# EAGLE board SchematicControlPlotter (EAGLE 9.1.2), part 1 of 2
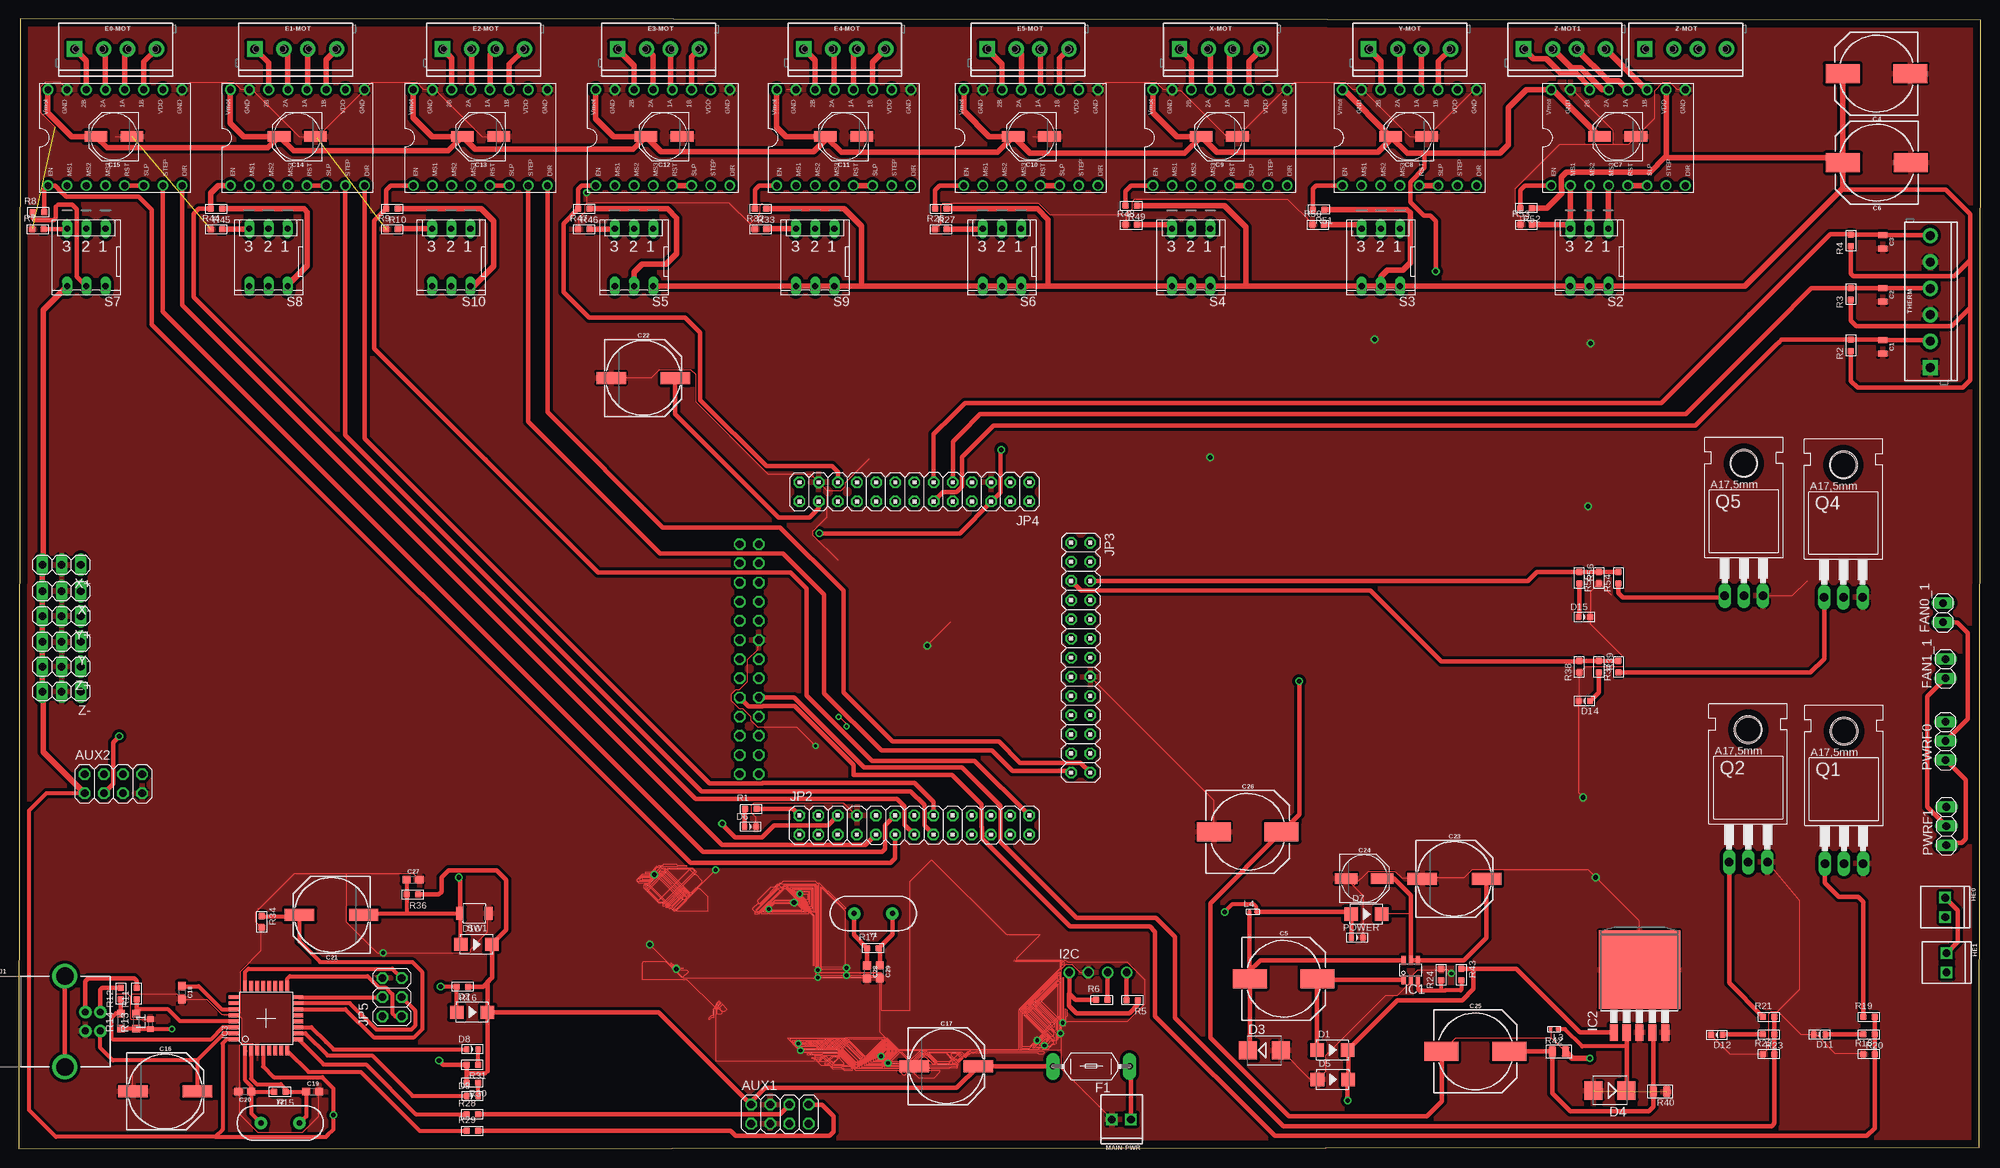
[diagram p5: board, top side]
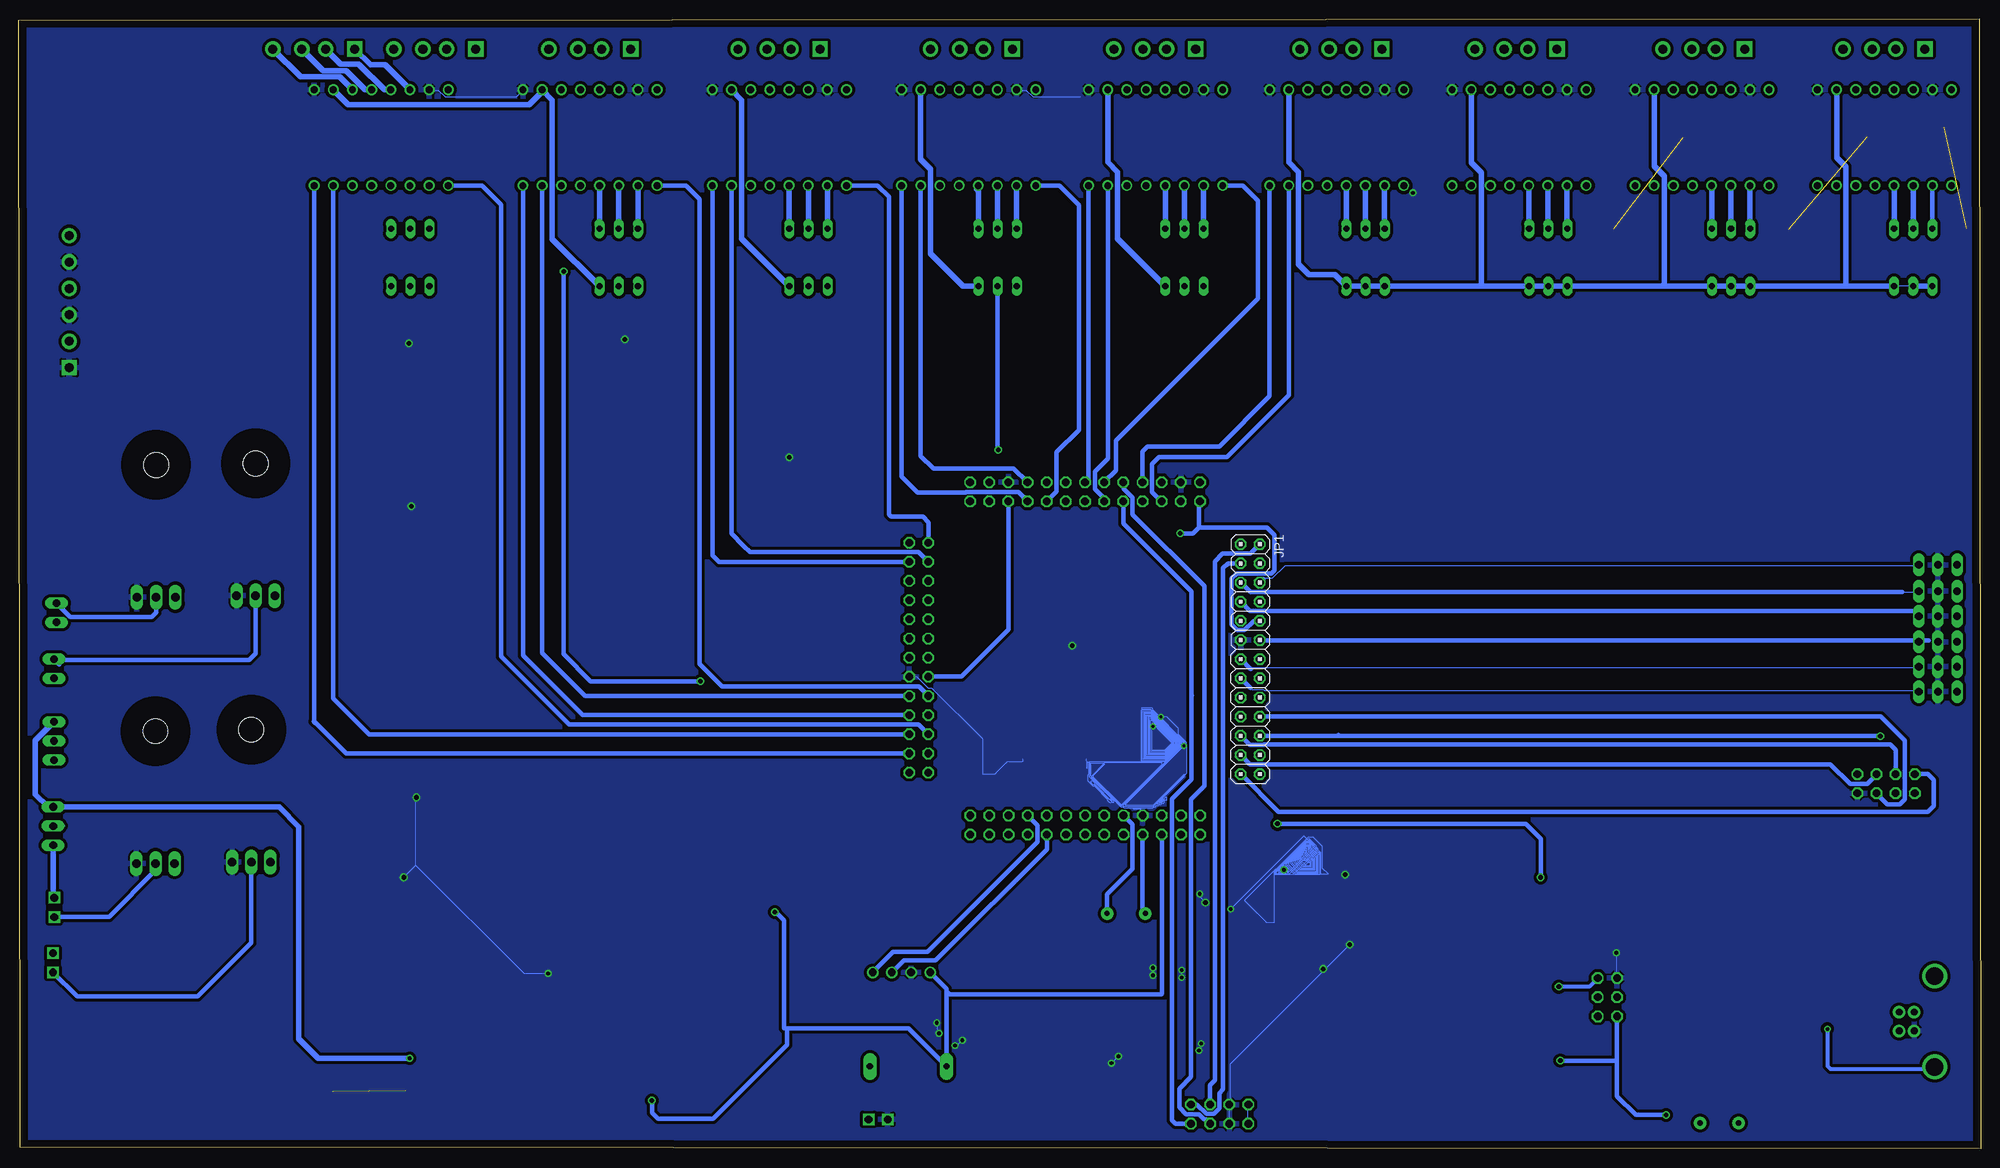
[diagram p6: board, bottom side, seen from below]

Size 260 x 149.8 mm. Coordinates in mm from the lower left corner, seen from the top.
Outline: 0,0 259.8,0.2 260,149.6 0.2,149.8 0,0
Copper layers (1*16): Top 0.035mm / dielectric 1.5mm / Bottom 0.035mm
Design rules "default": minimum track width 6mil, minimum drill 0.35mm, track to track 6mil, track to pad 6mil, pad to pad 6mil, via to via 6mil, smd to smd 6mil, copper to edge 40mil, drill to drill 6mil, minimum pad ring 10mil, minimum via ring 8mil, stop-mask expansion 4mil, vias tented up to drill 0mil, thermal gap 10mil

## Footprints (pad centres in the part's own frame; a part is rotated, then mirrored left to right if it is on the bottom)
2X04 = drill 1.016 octagon: 1 -3.81,-1.27; 2 -3.81,1.27; 3 -1.27,-1.27; 4 -1.27,1.27; 5 1.27,-1.27; 6 1.27,1.27; 7 3.81,-1.27; 8 3.81,1.27
0805 = smd 0.8 x 1.2: 1 -0.9,0; 2 0.9,0
NIC_10X10.5_CAP = smd 4.5 x 2.5: + 4.5,0; - -4.5,0
PANASONIC_D = smd 3 x 1.4: + 2.4,0; - -2.4,0
PANASONIC_G = smd 3.9 x 1.6: + 4.25,0; - -4.25,0
0603 = smd 1.1 x 1: 1 -0.85,0; 2 0.85,0
DO-214AC = smd 1.8 x 1.77: 1 -2.042,0; 2 2.042,0
SMB = smd 2.4 x 2.4: A 2.2,0; C -2.2,0
LED-0603 = smd 0.762 x 0.889: + -0.762,0; - 0.762,0
SCREWTERMINAL-3.5MM-4_LOCK = drill 1.2 pad 2.032 square: 1 -0.178,0 | drill 1.2 pad 2.032: 2 3.678,0; 3 6.822,0; 4 10.678,0
LITTLEFUSE = drill 0.813 pad 1.778 long: 1 -5.08,0; 2 5.08,0
1X02 = drill 1.016 long: 1 -1.27,0; 2 1.27,0
1X02_2.54_SCREWTERM = drill 1.016 square: P1 2.54,0; P2 0,0
1X04 = drill 1.016: 1 -2.54,0; 2 0,0; 3 2.54,0; 4 5.08,0
SOT23-6 = smd 0.55 x 1.2: 1 -0.95,-1.3; 2 0,-1.3; 3 0.95,-1.3; 4 0.95,1.3; 5 0,1.3; 6 -0.95,1.3
TO263-5 = smd 1.067 x 2.159: 1 -3.404,-5.791; 2 -1.702,-5.791; 3 0,-5.791; 4 1.702,-5.791; 5 3.404,-5.791 | smd 10.8 x 10.41: 6 0,2.54
TQFP32-08 = smd 1.27 x 0.508: 1 -4.293,2.8; 2 -4.293,2; 3 -4.293,1.2; 4 -4.293,0.4; 5 -4.293,-0.4; 6 -4.293,-1.2; 7 -4.293,-2; 8 -4.293,-2.8; 17 4.293,-2.8; 18 4.293,-2; 19 4.293,-1.2; 20 4.293,-0.4; 21 4.293,0.4; 22 4.293,1.2; 23 4.293,2; 24 4.293,2.8 | smd 0.508 x 1.27: 9 -2.8,-4.293; 10 -2,-4.293; 11 -1.2,-4.293; 12 -0.4,-4.293; 13 0.4,-4.293; 14 1.2,-4.293; 15 2,-4.293; 16 2.8,-4.293; 25 2.8,4.293; 26 2,4.293; 27 1.2,4.293; 28 0.4,4.293; 29 -0.4,4.293; 30 -1.2,4.293; 31 -2,4.293; 32 -2.8,4.293
USB-B-PTH = drill 0.914 pad 1.676: D+ 4,1.25; D- 5.981,1.25; GND 4,-1.25; VBUS 5.981,-1.25 | drill 2.286: SHLD1 1.282,-6.02; SHLD2 1.282,6.02
2X13 = drill 1.016 octagon: 1 -15.24,-1.27; 2 -15.24,1.27; 3 -12.7,-1.27; 4 -12.7,1.27; 5 -10.16,-1.27; 6 -10.16,1.27; 7 -7.62,-1.27; 8 -7.62,1.27; 9 -5.08,-1.27; 10 -5.08,1.27; 11 -2.54,-1.27; 12 -2.54,1.27; 13 0,-1.27; 14 0,1.27; 15 2.54,-1.27; 16 2.54,1.27; 17 5.08,-1.27; 18 5.08,1.27; 19 7.62,-1.27; 20 7.62,1.27; 21 10.16,-1.27; 22 10.16,1.27; 23 12.7,-1.27; 24 12.7,1.27; 25 15.24,-1.27; 26 15.24,1.27
2X03 = drill 1.016 octagon: 1 -2.54,-1.27; 2 -2.54,1.27; 3 0,-1.27; 4 0,1.27; 5 2.54,-1.27; 6 2.54,1.27
0402 = smd 0.7 x 0.9: 1 -0.65,0; 2 0.65,0
L0402 = smd 0.5 x 0.5: 1 -0.463,0; 2 0.463,0
1X03 = drill 1.016 long: 1 -2.54,0; 2 0,0; 3 2.54,0
TO220BH = drill 1.118 long: D 0,-6.35; G -2.54,-6.35; S 2.54,-6.35 | hole 3.302: 0,11.176
R0603 = smd 0.889 x 0.889: 1 0,0.762; 2 0,-0.762
CT/CN0603 = smd 1 x 1: 1 -1,0; 2 1,0
R0805 = smd 1.397 x 1.016: 1 0,0.889; 2 0,-0.889
DP-03 = drill 0.813 long: 1 -2.54,-3.81; 2 0,-3.81; 3 2.54,-3.81; 4 2.54,3.81; 5 0,3.81; 6 -2.54,3.81
SW2-2.6-3.0X2.5X1.2+0.4MM = smd 1 x 1.7: 1 -1.9,0; 2 1.9,0
SCREWTERMINAL-3.5MM-6 = drill 1.2 pad 2.032 square: 1 0,0 | drill 1.2 pad 2.032: 2 3.5,0; 3 7,0; 4 10.5,0; 5 14,0; 6 17.5,0
A4988BREAKOUT = drill 0.9: 1A 8.89,1.27; 1B 11.43,1.27; 2A 6.35,1.27; 2B 3.81,1.27; DIR 16.51,-11.43; EN -1.27,-11.43; GND 16.51,1.27; GND@0 1.27,1.27; MS1 1.27,-11.43; MS2 3.81,-11.43; MS3 6.35,-11.43; RST 8.89,-11.43; SLP 11.43,-11.43; STEP 13.97,-11.43; VDD 13.97,1.27; VMOT -1.27,1.27
HC49US = drill 0.7 pad 1.651: 1 -2.54,0; 2 2.54,0

## Placement (x,y rotation side)
AUX1  [2X04]  100.86,4.61 0 top
AUX2  [2X04]  12.53,48.41 0 top
C1  1.0uF  [0805]  247.01,106.3 270 top
C2  1.0uF  [0805]  247.01,113.21 270 top
C3  1.0uF  [0805]  247.01,120.22 270 top
C4  100uF  [NIC_10X10.5_CAP]  246.2,142.54 180 top
C5  100nF  [NIC_10X10.5_CAP]  167.63,22.56 0 top
C6  100uF  [NIC_10X10.5_CAP]  246.24,130.74 180 top
C7  100uF  [PANASONIC_D]  211.9,134.2 180 top
C8  100uF  [PANASONIC_D]  184.2,134.2 180 top
C9  100uF  [PANASONIC_D]  159.1,134.2 180 top
C10  100uF  [PANASONIC_D]  134.2,134.2 180 top
C11  100uF  [PANASONIC_D]  109.3,134.2 180 top
C12  100uF  [PANASONIC_D]  85.5,134.2 180 top
C13  100uF  [PANASONIC_D]  61.2,134.2 180 top
C14  100uF  [PANASONIC_D]  36.9,134.2 180 top
C15  100uF  [PANASONIC_D]  12.6,134.2 180 top
C16  100nF  [PANASONIC_G]  19.39,7.63 0 top
C17  100nF  [PANASONIC_G]  122.91,10.97 0 top
C18  1.0uF  [0603]  21.61,20.73 270 top
C19  22pF  [0603]  38.94,7.59 0 top
C20  22pF  [0603]  29.95,7.59 180 top
C21  100nF  [PANASONIC_G]  41.45,31.03 180 top
C22  100nF  [PANASONIC_G]  82.75,102.2 0 top
C23  100nF  [PANASONIC_G]  190.25,35.8 0 top
C24  47UF-POLAR-PANASONIC_D-50V-20%  [PANASONIC_D]  178.3,35.86 0 top
C25  100nF  [NIC_10X10.5_CAP]  193.03,12.93 0 top
C26  100uF  [NIC_10X10.5_CAP]  162.86,42.03 0 top
C27  22pF  [0603]  52.24,35.71 0 top
C28  22pF  [0603]  112.41,23.47 270 top
C29  22pF  [0603]  114.11,23.48 270 top
D1  40V-1A  [DO-214AC]  174.09,13.12 0 top
D2  CD1206-S01575  [DO-214AC]  60.07,18.12 0 top
D3  MBRM140  [SMB]  165.09,13.06 0 top
D4  MURS320  [SMB]  210.87,7.74 180 top
D5  40V-1A  [DO-214AC]  174.14,9.22 0 top
D6  YELLOW-0603  [LED-0603]  96.95,42.72 0 top
D7  40V-1A  [DO-214AC]  178.59,31.12 0 top
D8  YELLOW-0603  [LED-0603]  60.1,13.22 0 top
D9  YELLOW-0603  [LED-0603]  60.1,7.02 0 top
D10  CD1206-S01575  [DO-214AC]  60.64,27.12 0 top
D11  GREEN-0603  [LED-0603]  238.65,15.18 180 top
D12  GREEN-0603  [LED-0603]  225.03,15.12 180 top
D14  GREEN-0603  [LED-0603]  207.49,59.38 180 top
D15  GREEN-0603  [LED-0603]  207.49,70.52 0 top
E0-MOT  [SCREWTERMINAL-3.5MM-4_LOCK]  7.56,145.8 0 top
E1-MOT  [SCREWTERMINAL-3.5MM-4_LOCK]  31.45,145.8 0 top
E2-MOT  [SCREWTERMINAL-3.5MM-4_LOCK]  56.33,145.8 0 top
E3-MOT  [SCREWTERMINAL-3.5MM-4_LOCK]  79.52,145.8 0 top
E4-MOT  [SCREWTERMINAL-3.5MM-4_LOCK]  104.21,145.8 0 top
E5-MOT  [SCREWTERMINAL-3.5MM-4_LOCK]  128.5,145.8 0 top
F1  MFR500  [LITTLEFUSE]  142.14,10.94 180 top
FAN0_1  [1X02]  255.03,71.08 90 top
FAN1_1  [1X02]  255.33,63.66 90 top
HE0  [1X02_2.54_SCREWTERM]  255.31,33.29 270 top
HE1  [1X02_2.54_SCREWTERM]  255.49,25.94 270 top
I2C  [1X04]  141.75,23.4 0 top
IC1  [SOT23-6]  184.48,23.72 0 top
IC2  [TO263-5]  214.78,21.22 0 top
IC3  ATMEGA16U2-AU-TQFP  [TQFP32-08]  32.77,17.33 90 top
J1  USB_B_PTH  [USB-B-PTH]  4.82,16.89 0 top
JP1  [2X13]  96.79,64.93 270 bottom
JP2  [2X13]  118.68,42.94 0 top
JP3  [2X13]  140.73,65.12 270 top
JP4  [2X13]  118.7,87.1 180 top
JP5  [2X03]  49.47,20.11 90 top
L1  BLM15HB121SN1  [0402]  17.43,16.55 90 top
L3  47mH  [L0402]  203.47,15.88 180 top
L4  33mH  [L0402]  163.55,31.42 0 top
MAIN-PWR  [1X02_2.54_SCREWTERM]  147.39,3.91 180 top
POWER  GREEN-0603  [LED-0603]  177.37,28.02 0 top
PWRF0  [1X03]  255.35,54.08 90 top
PWRF1  [1X03]  255.45,42.79 90 top
Q1  PSMN7R0-60YS  [TO220BH]  241.89,44.19 0 top
Q2  PSMN7R0-60YS  [TO220BH]  229.2,44.39 0 top
Q4  PSMN7R0-60YS  [TO220BH]  241.81,79.49 0 top
Q5  PSMN7R0-60YS  [TO220BH]  228.62,79.69 0 top
R1  1K  [R0603]  97.02,45.06 270 top
R2  4.7K  [R0603]  242.8,106.52 0 top
R3  4.7K  [R0603]  242.8,113.32 0 top
R4  4.7K  [R0603]  242.8,120.42 0 top
R5  4.7K  [R0603]  147.58,19.72 90 top
R6  4.7K  [R0603]  143.52,19.76 270 top
R7  100K  [R0603]  2.52,121.9 270 top
R8  10K  [R0603]  2.58,124.18 270 top
R9  100K  [R0603]  49.46,121.9 270 top
R10  10K  [R0603]  49.46,124.62 90 top
R11  22R  [R0603]  15.6,20.6 0 top
R12  22R  [R0603]  13.53,20.6 0 top
R13  VARISTORCN0603  [CT/CN0603]  15.55,16.93 90 top
R14  VARISTORCN0603  [CT/CN0603]  13.55,16.97 90 top
R15  1M  [R0603]  34.6,7.58 90 top
R16  10K  [R0603]  58.8,21.5 90 top
R17  1M  [R0603]  113.2,26.62 270 top
R18  100K  [R0603]  245.2,12.56 270 top
R19  10R  [R0603]  245.2,17.5 270 top
R20  1K  [R0603]  245.2,15.18 90 top
R21  10R  [R0603]  231.92,17.5 270 top
R22  100K  [R0603]  231.92,12.56 270 top
R23  1K  [R0603]  231.92,15.18 90 top
R24  10K  [R0603]  188.5,23.1 0 top
R26  100K  [R0603]  122.2,121.9 270 top
R27  10K  [R0603]  122.2,124.62 90 top
R28  1K  [R0603]  60.1,4.6 270 top
R29  1K  [R0603]  60.1,2.38 270 top
R30  1K  [R0603]  60.1,8.8 90 top
R31  1K  [R0603]  60.1,11.16 90 top
R32  100K  [R0603]  98.3,121.9 270 top
R33  10K  [R0603]  98.3,124.62 90 top
R34  1K  [R0603]  32.18,30.1 180 top
R36  10K  [R0603]  52.18,33.74 90 top
R37  10R  [R0603]  212,63.9 0 top
R38  100K  [R0603]  206.8,63.9 0 top
R39  1K  [R0603]  209.4,63.9 180 top
R40  1K  [R0805]  217.52,7.61 270 top
R42  8.7K  [R0805]  204.12,12.89 90 top
R43  30K  [R0603]  191.18,23.1 180 top
R44  100K  [R0603]  26.16,121.9 270 top
R45  10K  [R0603]  26.16,124.62 90 top
R46  10K  [R0603]  74.9,124.62 90 top
R47  100K  [R0603]  74.9,121.9 270 top
R48  100K  [R0603]  147.42,122.5 270 top
R49  10K  [R0603]  147.42,125.02 90 top
R50  100K  [R0603]  172.18,122.5 270 top
R51  10K  [R0603]  172.28,124.52 90 top
R52  10K  [R0603]  199.78,124.72 90 top
R53  100K  [R0603]  199.78,122.5 270 top
R54  10R  [R0603]  212,75.7 0 top
R55  100K  [R0603]  209.4,75.7 0 top
R56  1K  [R0603]  206.8,75.7 180 top
S2  [DP-03]  208.14,118.18 180 top
S3  [DP-03]  180.5,118.18 180 top
S4  [DP-03]  155.36,118.18 180 top
S5  [DP-03]  81.52,118.18 180 top
S6  [DP-03]  130.28,118.18 180 top
S7  [DP-03]  8.94,118.18 180 top
S8  [DP-03]  33.08,118.18 180 top
S9  [DP-03]  105.54,118.18 180 top
S10  [DP-03]  57.3,118.18 180 top
SW1  B3U-1000P-2P-SMD  [SW2-2.6-3.0X2.5X1.2+0.4MM]  60.36,31.22 180 top
THERM  [SCREWTERMINAL-3.5MM-6]  253.32,103.57 90 top
U$1  A4988BREAKOUT  [A4988BREAKOUT]  5.12,139.13 0 top
U$2  A4988BREAKOUT  [A4988BREAKOUT]  29.3,139.13 0 top
U$4  A4988BREAKOUT  [A4988BREAKOUT]  176.68,139.13 0 top
U$5  A4988BREAKOUT  [A4988BREAKOUT]  204.36,139.13 0 top
U$7  A4988BREAKOUT  [A4988BREAKOUT]  53.54,139.13 0 top
U$8  A4988BREAKOUT  [A4988BREAKOUT]  77.72,139.13 0 top
U$9  A4988BREAKOUT  [A4988BREAKOUT]  101.72,139.13 0 top
U$10  A4988BREAKOUT  [A4988BREAKOUT]  126.5,139.13 0 top
X  A4988BREAKOUT  [A4988BREAKOUT]  151.58,139.13 0 top
X+  [1X03]  5.67,77.43 180 top
X-  [1X03]  5.67,73.93 180 top
X-MOT  [SCREWTERMINAL-3.5MM-4_LOCK]  153.99,145.8 0 top
Y1  16MHz  [HC49US]  113.24,31.22 180 top
Y2  16MHz  [HC49US]  34.64,3.42 0 top
Y+  [1X03]  5.67,70.63 180 top
Y-  [1X03]  5.67,67.23 180 top
Y-MOT  [SCREWTERMINAL-3.5MM-4_LOCK]  179.08,145.8 0 top
Z+  [1X03]  5.67,63.93 180 top
Z-  [1X03]  5.67,60.63 180 top
Z-MOT  [SCREWTERMINAL-3.5MM-4_LOCK]  215.67,145.8 0 top
Z-MOT1  [SCREWTERMINAL-3.5MM-4_LOCK]  199.63,145.8 0 top